# Altium schematic sheet Connectors.SchDoc
size A; SheetNumber: 9; SheetTotal: 10
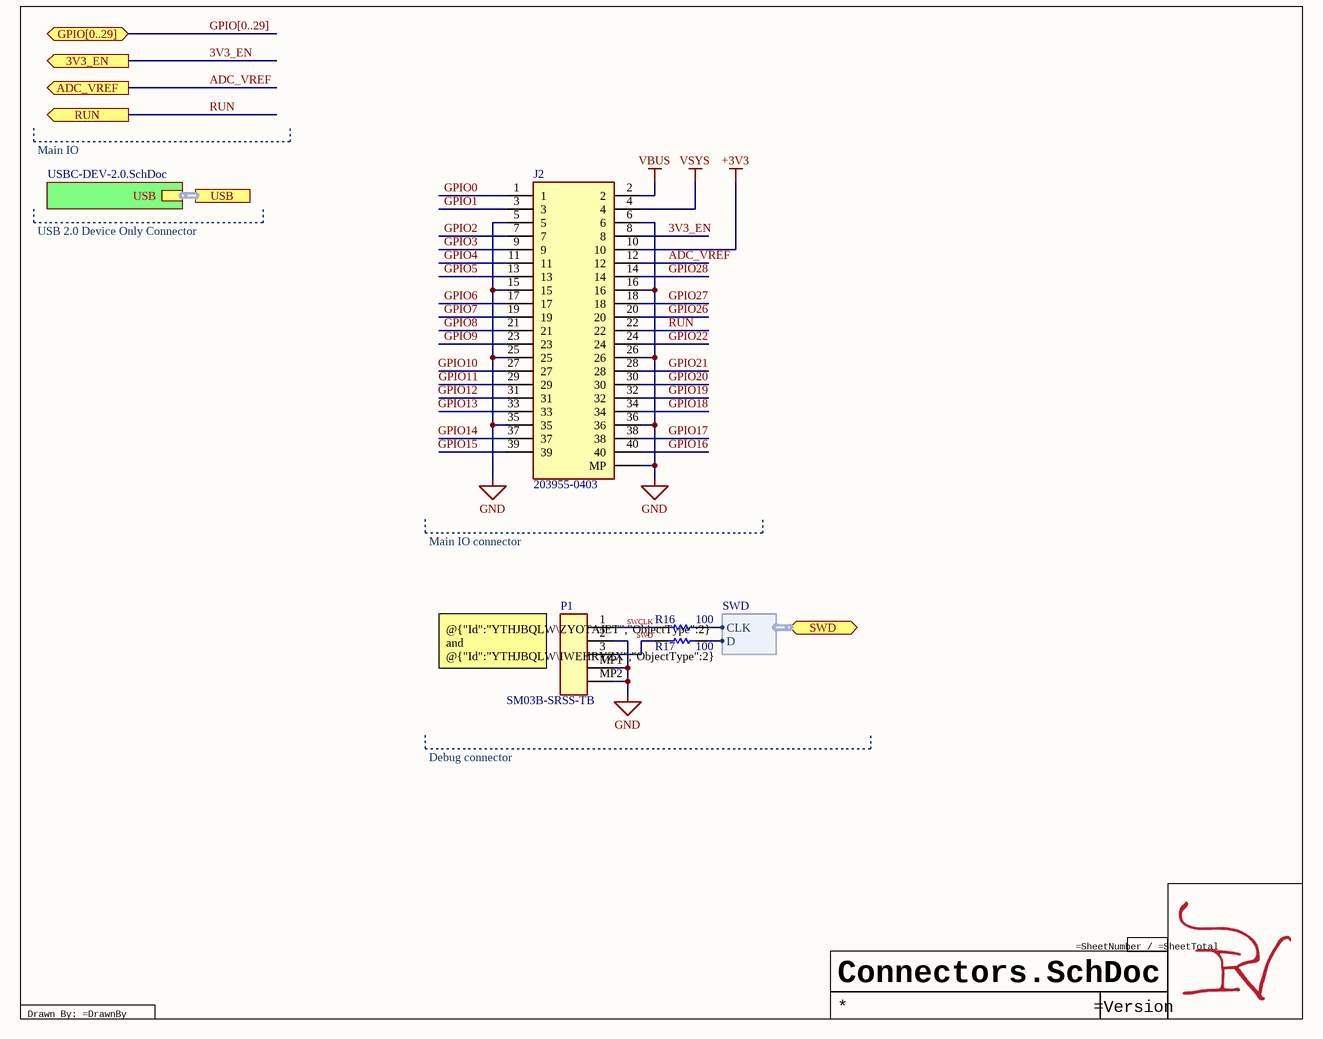
[diagram p0: Connectors.SchDoc]

## Parts
J2  203955-0403  [2039550403]
P1  SM03B-SRSS-TB  [JST-SM03B-SRSS-TB_V]
R16  value 100  [RES 0201_0603]  (hidden comment: 100-0201-0.05/1)
R17  value 100  [RES 0201_0603]  (hidden comment: 100-0201-0.05/1)

## Sub-sheets
U_USBC-DEV-2.0 = USBC-DEV-2.0.SchDoc: USB (harness USB 2.0)

## Ports
3V3_EN (out, see 2040Macro-PCB[2B]), ADC_VREF (out, see 2040Macro-PCB[2B], RP2040[1B]), GPIO[0..29] (bidir, see 2040Macro-PCB[2B], RP2040[1B]), RUN (out, see 2040Macro-PCB[2B], RP2040[1B]), SWD (bidir, harness SWD, see 2040Macro-PCB[2B], RP2040[1A]), USB (harness USB 2.0, see 2040Macro-PCB[2B], RP2040[1A], USBC-DEV-2.0[3B])

## Harnesses
SWD: CLK, D

## Nets
+3V3: J2.10
GND: J2.5 J2.6 J2.15 J2.16 J2.25 J2.26 J2.35 J2.36 J2.MP1,_MP2,_MP3,_MP4(MP) P1.2 P1.MP1 P1.MP2
VBUS: J2.2
VSYS: J2.4
3V3_EN: J2.8 ; port 3V3_EN
ADC_VREF: J2.12 ; port ADC_VREF
GPIO0: J2.1
GPIO1: J2.3
GPIO2: J2.7
GPIO3: J2.9
GPIO4: J2.11
GPIO5: J2.13
GPIO6: J2.17
GPIO7: J2.19
GPIO8: J2.21
GPIO9: J2.23
GPIO10: J2.27
GPIO11: J2.29
GPIO12: J2.31
GPIO13: J2.33
GPIO14: J2.37
GPIO15: J2.39
GPIO16: J2.40
GPIO17: J2.38
GPIO18: J2.34
GPIO19: J2.32
GPIO20: J2.30
GPIO21: J2.28
GPIO22: J2.24
GPIO26: J2.20
GPIO27: J2.18
GPIO28: J2.14
RUN: J2.22 ; port RUN
SWCLK: P1.1 R16.1
SWD: P1.3 R17.1
NetR16_2: R16.2 ; port SWD.CLK
NetR17_2: R17.2 ; port SWD.D

## Buses and harness runs
bus GPIO[0..29] = port GPIO[0..29]
harness port USB = sheet U_USBC-DEV-2.0/USB

## Notes on the sheet
- Main IO
- USB 2.0 Device Only Connector
- Main IO connector
- (near P1) @{"Id":"YTHJBQLW\ZYOTAJET","ObjectType":2} and @{"Id":"YTHJBQLW\IWEHRYZX","ObjectType":2} must be placed very close RP2040
- Debug connector
- Drawn By: =DrawnBy

## Library data of the parts
J2 = CMP-702-000003-3: SlimStack Board-to-Board Receptacle, 0.40mm Pitch, FSB5 Floating Series, 5.00mm Mated Height, 3.80mm Mated Width, 40...; Manufacturer_Name: Molex; Mouser Price/Stock: https://www.mouser.co.uk/ProductDetail/Molex/203955-0403?qs=GBLSl2Akirtl%2FPuTWbQ1%252BQ%3D%3D; Height: 3.1mm; Design Item ID: 203955-0403; Mouser Part Number: 538-203955-0403; Manufacturer_Part_Number: 203955-0403; Datasheet Link: https://www.molex.com/pdm_docs/sd/2039550403_sd.pdf; Source: SamacSys.SchLib
P1 = CMP-002-00021-1: CONN HEADER SH 3POS SIDE 1MM TIN
R16 R17 = CMP-009-00050-3: Fixed Resistor, Metal Glaze/thick Film, 0.05W, 100ohm, 25V, 1% +/-Tol, 200ppm/Cel, Surface Mount, 0201; Power: 50mW; Package Height: 0.23mm; Package Length: 0.6mm; Package Width: 0.3mm; Rated Temperature: 70°C; Reference Standard: AEC-Q200; Temperature Coefficient: 200ppm/°C; RoHS Compliant: Yes; Max Operating Temperature: 125°C; Min Operating Temperature: -55°C; Case/Package: 0201; Tolerance: 1%; Mounting Technology: Surface Mount; Pins: 2; Construction: Rectangular; JESD-609 Code: e3; Package Shape: Rectangular; Package Style: SMTMeter; Packaging: Tape and Reel; Reach SVHC Compliant: Yes; Resistor Type: FIXED RESISTOR; Technology: METAL GLAZE/THICK FILM; Terminal Finish: Nickel; Termination: Wraparound; Working Voltage: 25V